# EAGLE design Programming Adaptor v5.0 (EAGLE 6.5.0)
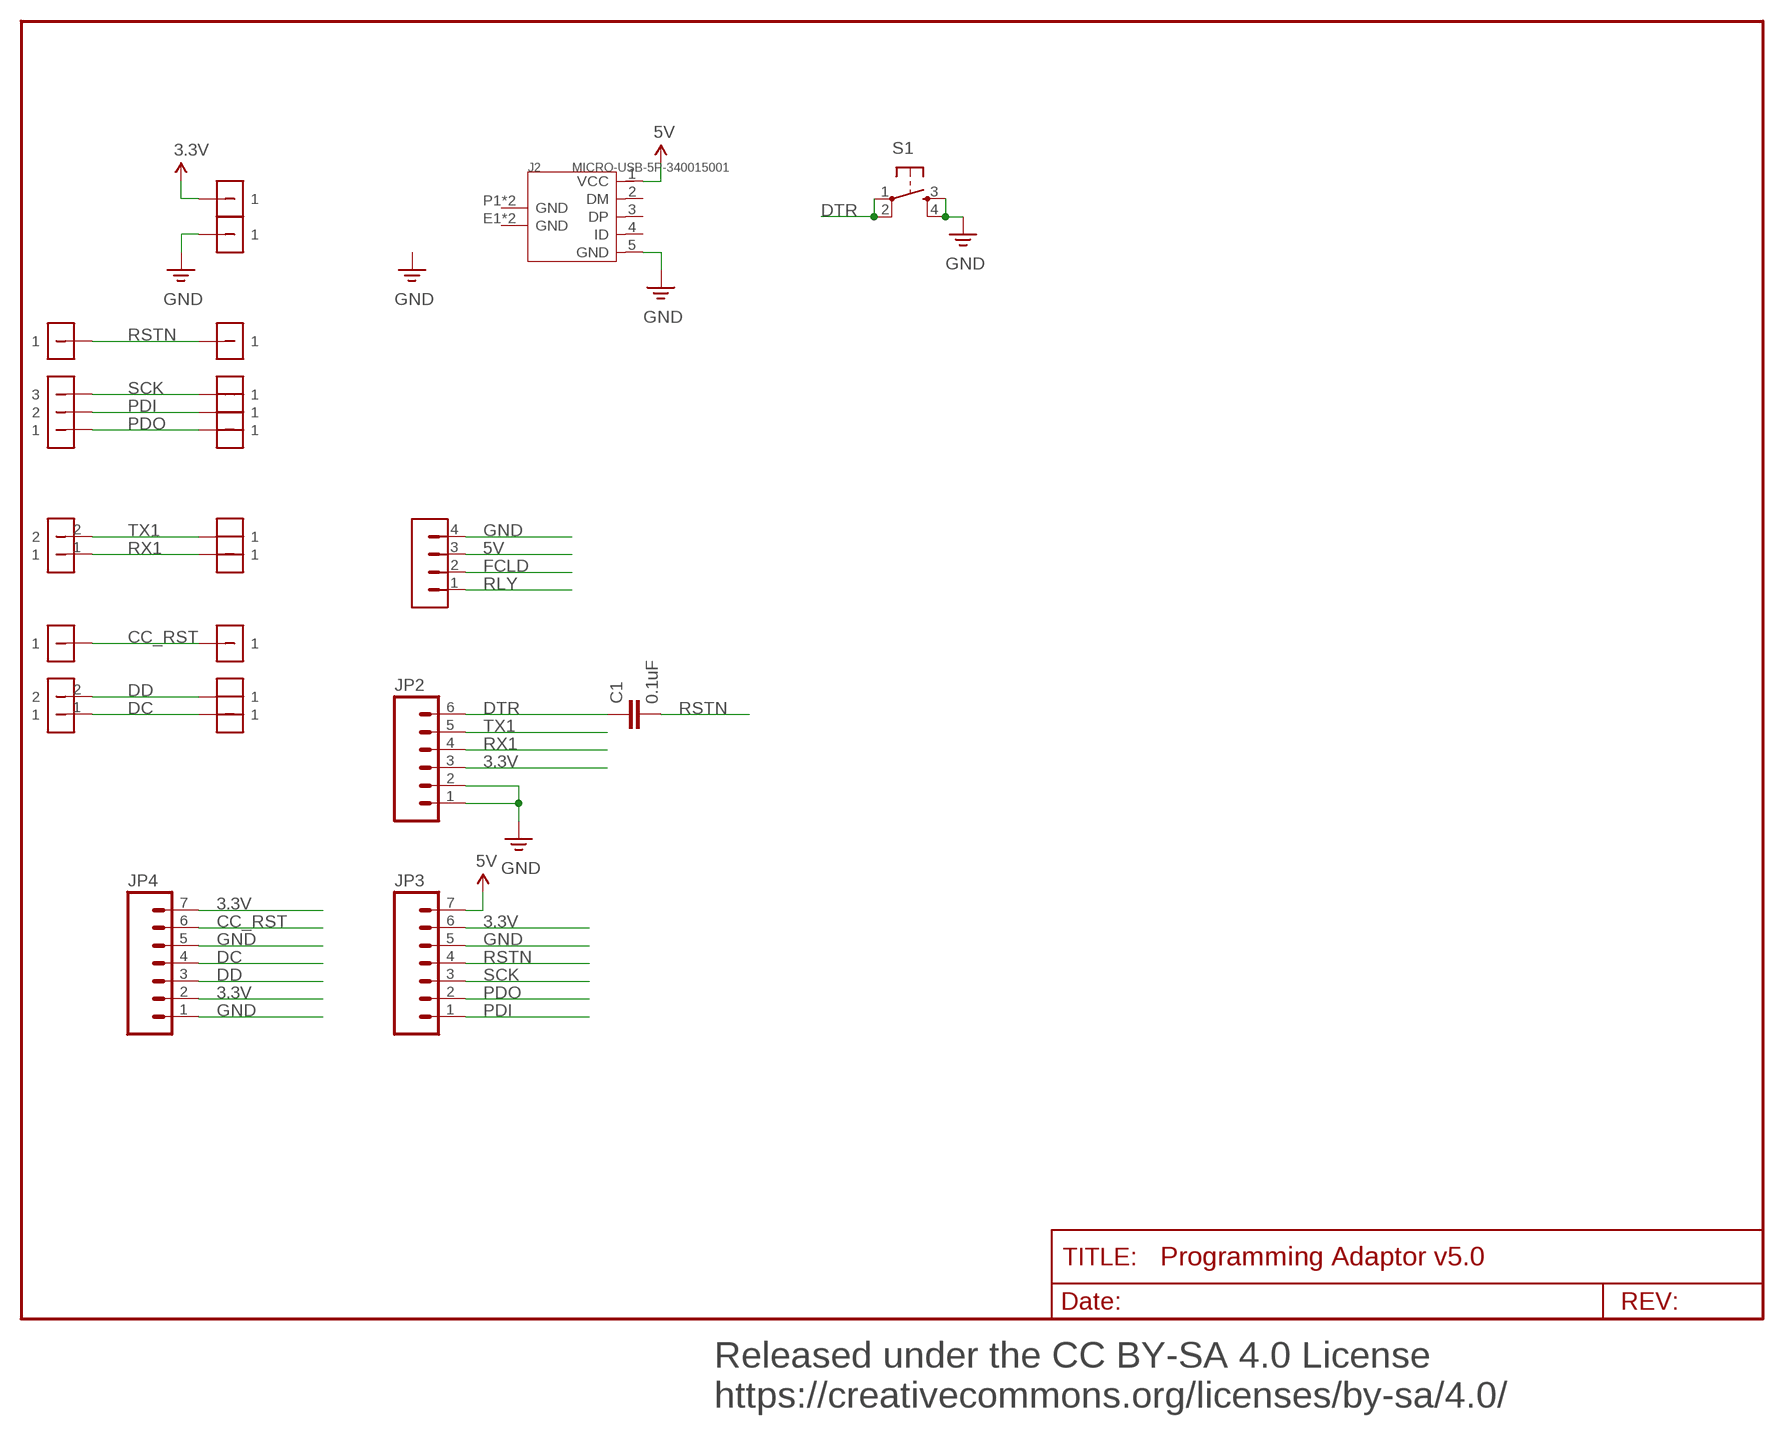
[diagram p0: schematic, sheet 1]

## Parts
C1  0.1uF  CAP0603-CAP  [0603-CAP]
J2  MICRO-USB-5P-340015001  [B-SMD-5P]
JP1  M02  [M02]
JP2  M06LOCK  [1X06_LOCK]
JP3  M07  [1X07]
JP4  M07  [1X07]
S1  TAC_SWITCHSMD  [TACTILE-SWITCH-SMD]
U$4  M03  [M03]
U$5  S04-4MM  [S04-4MM]
U$7  M01  [M01]
U$8  M01  [M01]
U$9  M02  [M02]
U$11  S01C-4MM  [S01C-4MM]
U$12  S01C-4MM  [S01C-4MM]
U$13  S01C-4MM  [S01C-4MM]
U$14  S01C-4MM  [S01C-4MM]
U$15  S01C-4MM  [S01C-4MM]
U$16  S01C-4MM  [S01C-4MM]
U$17  S01C-4MM  [S01C-4MM]
U$18  S01C-4MM  [S01C-4MM]
U$19  S01C-4MM  [S01C-4MM]
U$20  S01C-4MM  [S01C-4MM]
U$21  S01C-4MM  [S01C-4MM]

## Nets
3.3V: JP2.3 JP3.6 JP4.2 JP4.7 U$20.P$1
5V: J2.1(VCC) JP3.7 U$5.3
CC_RST: JP4.6 U$8.1 U$17.P$1
DC: JP4.4 U$9.1 U$19.P$1
DD: JP4.3 U$9.2 U$18.P$1
DTR: C1.1 JP2.6 S1.1 S1.2
FCLD: U$5.2
GND: J2.5(GND) JP2.1 JP2.2 JP3.5 JP4.1 JP4.5 S1.3 S1.4 U$5.4 U$21.P$1
PDI: JP3.1 U$4.2 U$13.P$1
PDO: JP3.2 U$4.1 U$14.P$1
RLY: U$5.1
RSTN: C1.2 JP3.4 U$7.1 U$11.P$1
RX1: JP1.1 JP2.4 U$16.P$1
SCK: JP3.3 U$4.3 U$12.P$1
TX1: JP1.2 JP2.5 U$15.P$1
Unconnected: J2.2(DM) J2.3(DP) J2.4(ID) J2.E1(GND) J2.E2(GND) J2.P1(GND) J2.P2(GND)

## Notes on the sheet
- Released under the CC BY-SA 4.0 License 
  https://creativecommons.org/licenses/by-sa/4.0/

## Library data of the parts
C1 = SparkFun-Capacitors:CAP: Capacitor Standard 0603 ceramic capacitor, and 0.1" leaded capacitor.
J2 = Connector:MICRO-USB-5P: When you use the footprint ,place notice 46 (layer)milling ,there is some important information.
JP1 U$9 = pinhead-half:M02
JP2 = SparkFun-Connectors:M06: Header 6 Standard 6-pin 0.1" header. Use with straight break away headers (SKU : PRT-00116), right angle break away headers (PRT-00553), swiss pins (PRT-00743), machine pins (PRT-00117), and female headers (PRT-00115). Molex polarized connector foot print use with SKU : PRT-08094 with associated crimp pins and housings. NOTES ON THE VARIANTS LOCK and LOCK_LONGPADS... This footprint was designed to help hold the alignment of a through-hole component (i.e. 6-pin header) while soldering it into place. You may notice that each hole has been shifted either up or down by 0.005 of an inch from it's more standard position (which is a perfectly straight line). This slight alteration caused the pins (the squares in the middle) to touch the edges of the holes. Because they are alternating, it causes a "brace" to hold the component in place. 0.005 has proven to be the perfect amount of "off-center" position when using our standard breakaway headers. Although looks a little odd when you look at the bare footprint, once you have a header in there, the alteration is very hard to notice. Also,if you push a header all the way into place, it is covered up entirely on the bottom side. This idea of altering the position of holes to aid alignment will be further integrated into the Sparkfun Library for other footprints. It can help hold any component with 3 or more connection pins.
JP3 JP4 = SparkFun-Connectors:M07: Header 7 Standard 7-pin 0.1" header. Use with straight break away headers (SKU : PRT-00116), right angle break away headers (PRT-00553), swiss pins (PRT-00743), machine pins (PRT-00117), and female headers (PRT-00115). NOTES ON THE VARIANTS LOCK and LOCK_LONGPADS... This footprint was designed to help hold the alignment of a through-hole component (i.e. 7-pin header) while soldering it into place. You may notice that each hole has been shifted either up or down by 0.005 of an inch from it's more standard position (which is usually a perfectly straight line). This slight alteration caused the pins (the squares in the middle) to touch the edges of the holes. Because they are alternating, it causes a "brace" to hold the header in place. 0.005 has proven to be the perfect amount of "off-center" position when using our standard breakaway headers. Although looks a little odd when you look at the bare footprint, once you have a header in there, the alteration is very hard to notice. Also, if you push a header all the way into place, it is covered up entirely on the bottom side. This idea of altering the position of holes to aid alignment will be further integrated into the Sparkfun Library for other footprints. It can help hold any component with 3 or more connection pins.
S1 = SparkFun-Electromechanical:TAC_SWITCH: Momentary Switch Button commonly used for reset or general input. Spark Fun Electronics SKU : COM-00097 SMT- SWCH-08247
U$4 = pinhead-half:M03
U$5 = pinhead-half:S04-4MM
U$7 U$8 = pinhead-half:M01
U$11-U$21 = pinhead-half:S01C-4MM

## Net classes
1 Tline: width 0.003 mm, drill 0.33 mm
2 120v Mains 5A: clearance 1.27 mm

## Board
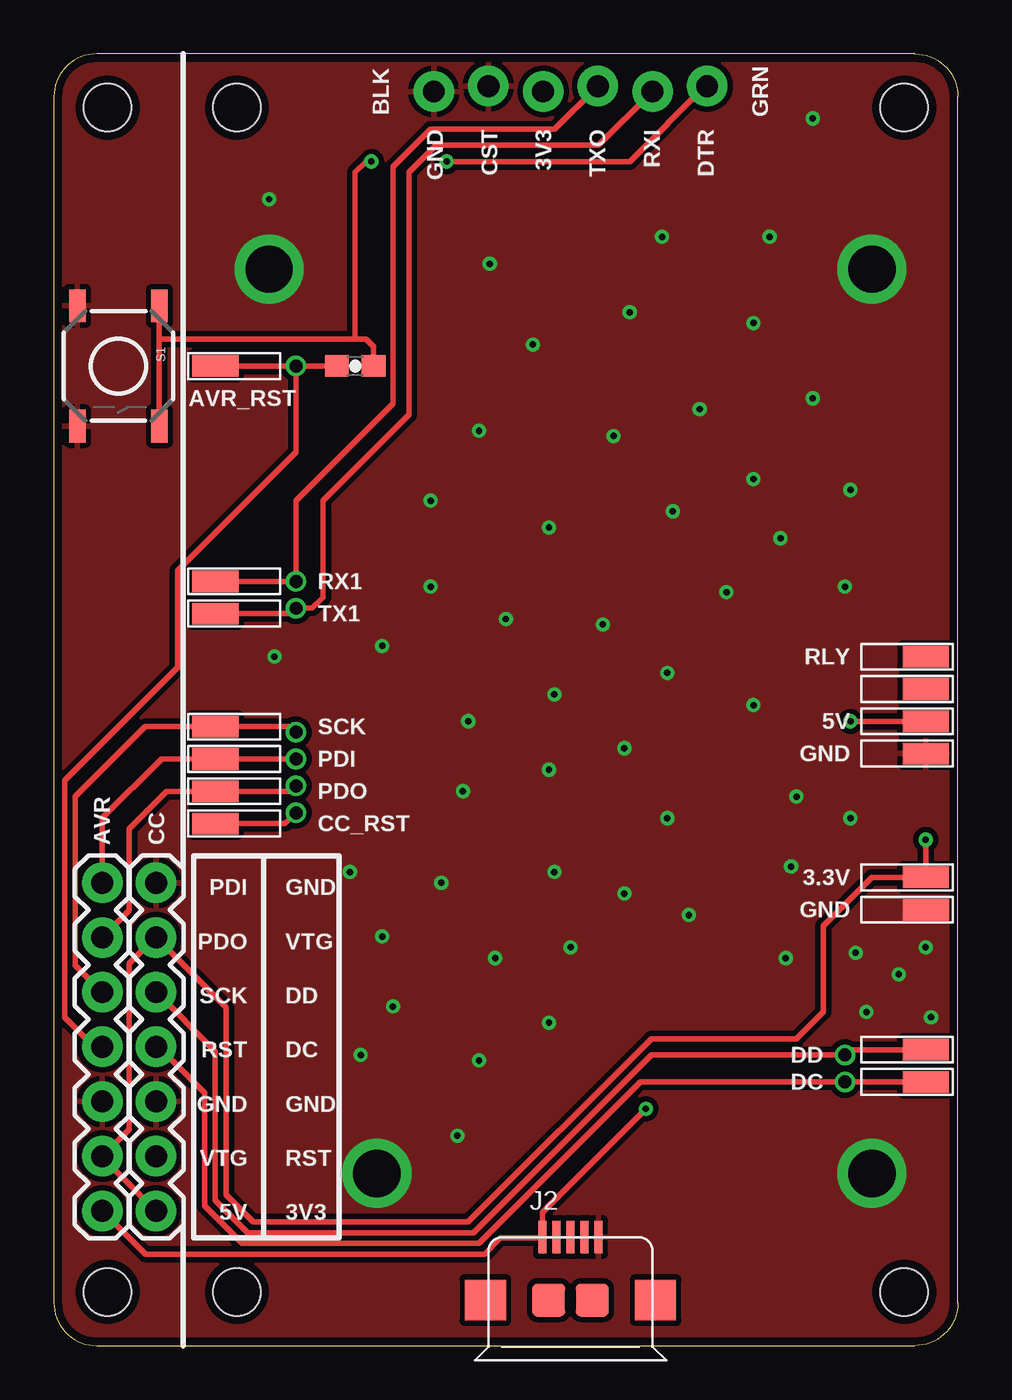
[diagram p1: board, top side]
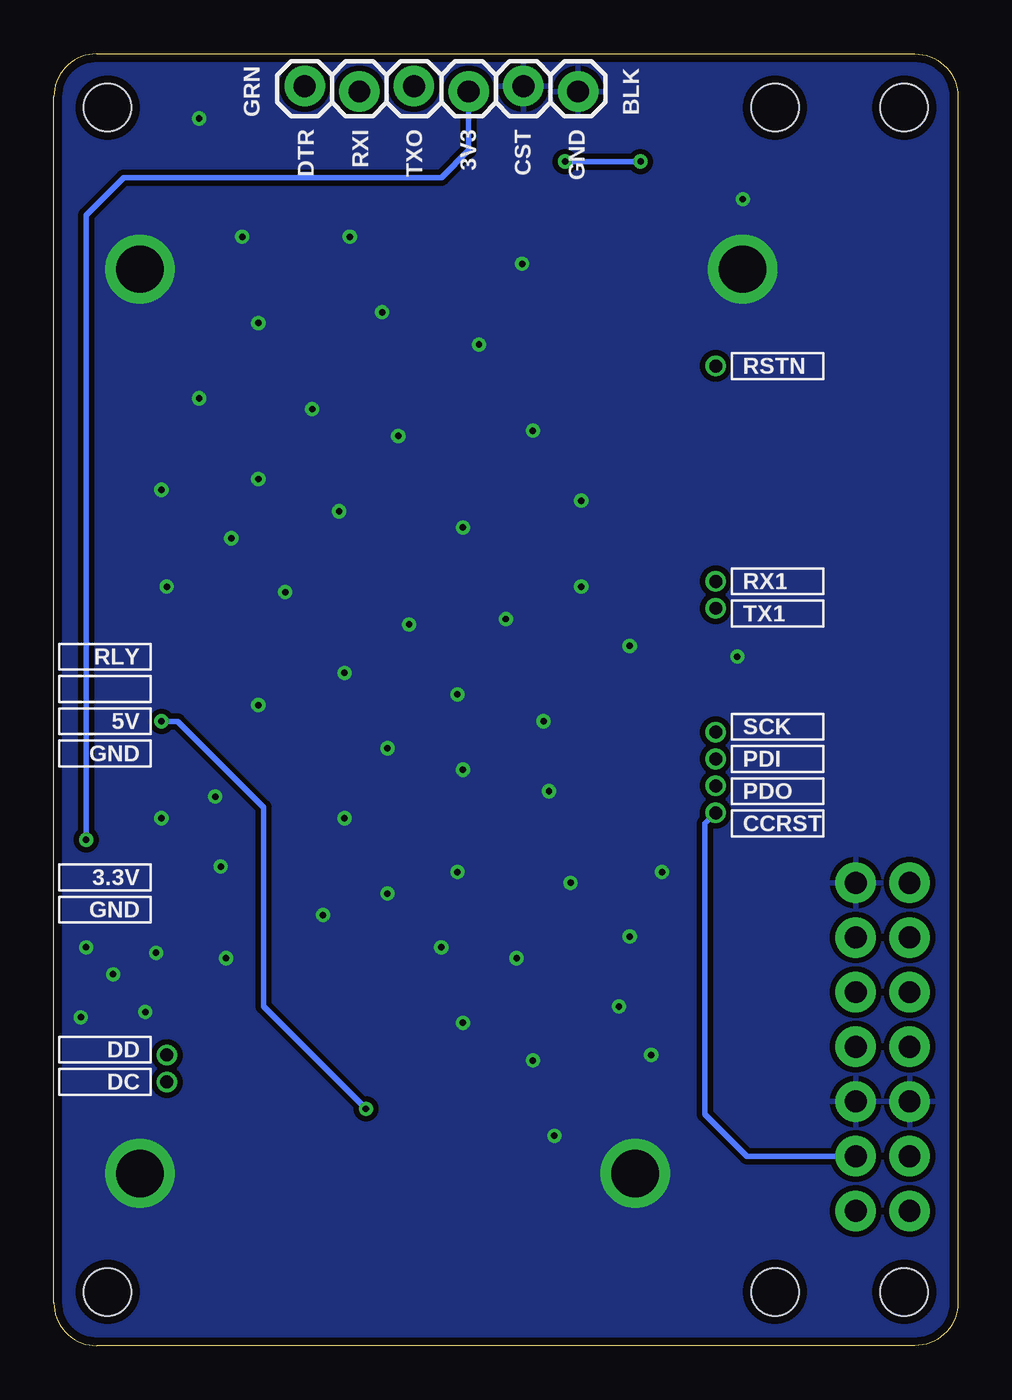
[diagram p2: board, bottom side, seen from below]

Size 42 x 60 mm. Coordinates in mm from the lower left corner, seen from the top.
Outline: 42,2 42,58 arc90 40,60 2,60 arc90 0,58 0,2 arc90 2,0 40,0 arc90 42,2
Copper layers (1*16): Top 0.0356mm / dielectric 1.5011mm / Bottom 0.0356mm
Design rules "LaenPCBOrder *": minimum track width 6mil, minimum drill 0.3mm, track to track 6mil, track to pad 6mil, pad to pad 6mil, via to via 6mil, smd to smd 6mil, copper to edge 15mil, drill to drill 6mil, minimum pad ring 7mil, minimum via ring 7mil, stop-mask expansion 3mil, vias tented up to drill 15mil, thermal gap 10mil
Holes 2.2 mm at 8.5,57.5 39.5,57.5 8.5,2.5 39.5,2.5 2.5,57.5 2.5,2.5

### Footprints (pad centres in the part's own frame; a part is rotated, then mirrored left to right if it is on the bottom)
0603-CAP = smd 1.1 x 1: 1 -0.85,0; 2 0.85,0
B-SMD-5P = smd 0.38 x 1.52: 1 -1.3,2.54; 2 -0.65,2.54; 3 0,2.54; 4 0.65,2.54; 5 1.3,2.54 | smd 1.524 x 1.524: E1 -1.016,-0.381; E2 1.016,-0.381 | smd 1.9 x 1.9: P1 -3.95,-0.381; P2 3.95,-0.381
M02 = drill 0.6: 1 0,0; 2 0,1.25
1X06_LOCK = drill 1.016 pad 1.88: 1 -6.35,0; 2 -3.81,-0.254; 3 -1.27,0; 4 1.27,-0.254; 5 3.81,0; 6 6.35,-0.254
1X07 = drill 1.016 pad 1.88: 1 0,0; 2 2.54,0; 3 5.08,0; 4 7.62,0; 5 10.16,0; 6 12.7,0; 7 15.24,0
TACTILE-SWITCH-SMD = smd 1.524 x 0.762: 1 -2.794,1.905; 2 2.794,1.905; 3 -2.794,-1.905; 4 2.794,-1.905
M03 = drill 0.6: 1 0,-1.25; 2 0,0; 3 0,1.25
S04-4MM = smd 2.15 x 1: 1 0,0; 2 0,1.5; 3 0,3; 4 0,4.5
M01 = drill 0.6: 1 0,0
S01C-4MM = smd 2.15 x 1: P$1 0,0

### Placement (x,y rotation side)
C1  14,45.5 180 top
J2  24,2.5 0 top
JP1  11.25,35.5 180 top
JP2  24,58.25 180 bottom
JP3  2.25,21.5 270 top
JP4  4.75,21.5 270 top
S1  3,45.5 270 top
U$4  11.25,27.25 0 top
U$5  40.5,32 180 top
U$7  11.25,45.5 0 bottom
U$8  11.25,24.75 0 top
U$9  36.75,12.25 0 top
U$11  7.5,45.5 0 top
U$12  7.5,28.75 0 top
U$13  7.5,27.25 0 top
U$14  7.5,25.75 0 top
U$15  7.5,34 0 top
U$16  7.5,35.5 0 top
U$17  7.5,24.25 0 top
U$18  40.5,13.75 180 top
U$19  40.5,12.25 180 top
U$20  40.5,21.75 180 top
U$21  40.5,20.25 180 top

### Tracks (layer width: path | path; a pad name or v marks a point on that pad's centre or on a via)
3.3V  (via drill 0.3)
  Top 0.25: JP4.7 4.64,6.5 4.5,6.5 2.2,8.8 JP3.6 3.5,10.05 3.5,17.75 4.62,18.87 JP4.2 8,15.71 8,7 9.25,5.75 19.25,5.75 27.75,14.25 34.5,14.25 35.75,15.5 35.75,19.5 38,21.75 U$20.P$1 v40.5,23.5
  Bottom 0.25: JP2.3 22.73,55.52 24,54.25 38.75,54.25 40.5,52.5 v40.5,23.5
5V  (via drill 0.3)
  Top 0.25: JP3.7 4.26,4.25 20,4.25 20.75,5 22.66,5 J2.1 22.7,6.2 v27.5,11 | v37,29 U$5.3
  Bottom 0.25: v27.5,11 32.25,15.75 32.25,25 36.25,29 v37,29
CC_RST
  Top 0.25: U$17.P$1 10.75,24.25 U$8.1
  Bottom 0.25: JP4.6 9.8,8.8 11.75,10.75 11.75,24.25 U$8.1
DC
  Top 0.25: U$19.P$1 U$9.1 27.25,12.25 19.75,4.75 8.75,4.75 7,6.5 7,11.75 4.87,13.88 JP4.4
DD
  Top 0.25: U$18.P$1 37,13.75 U$9.2 27.75,13.5 19.5,5.25 9,5.25 7.5,6.75 7.5,13.67 JP4.3
DTR  (via drill 0.3)
  Top 0.25: S1.1 4.91,46.75 | 4.91,46.75 S1.2 | C1.1 14.85,46.4 14.5,46.75 14,46.75 | 14,46.75 4.91,46.75 | JP2.6 30.25,58.5 26.75,55 v18.25,55 | v14.75,55 14.5,55 14,54.5 14,46.75
  Bottom 0.25: v18.25,55 v14.75,55
GND  (via drill 0.3, 2.2)
  other vias: 10,50 38,50 38,8 15,8 28.5,31.25 37,24.5 34.25,22.25 32.5,29.75 28.5,24.5 34,18 34.5,25.5 39.25,17.25 37.25,18.25 37.75,15.5 40.75,15.25 40.5,18.5 29.5,20 26.5,27.75 25.5,33.5 31.25,35 36.75,35.25 37,39.75 32.5,40.25 33.75,37.5 28.75,38.75 23,38 26,42.25 30,43.5 35.25,44 32.5,47.5 26.75,48 22.25,46.5 19.75,42.5 20.25,50.25 28.25,51.5 33.25,51.5 35.25,57 10,53.25 17.5,39.25 17.5,35.25 15.25,32.5 10.25,32 21,33.75 19.25,29 23,26.75 23.25,30.25 19,25.75 23.25,22 18,21.5 24,18.5 15.25,19 20.5,18 13.75,22 15.75,15.75 14.25,13.5 19.75,13.25 26.5,21 23,15 18.75,9.75
  pour Top (isolate 0.254): 44,62 -2,62 -2,-2 44,-2
  pour Bottom (isolate 0.254): -1,61 -1,-1 43,-1 43,61
PDI
  Top 0.25: U$4.2 U$13.P$1 5,27.25 2.25,24.5 JP3.1
PDO
  Top 0.25: U$4.1 11,25.75 U$14.P$1 5.25,25.75 3.5,24 3.5,20.21 JP3.2
RSTN
  Top 0.25: U$11.P$1 U$7.1 | U$7.1 C1.2 | JP3.4 1.87,13.88 0.5,15.25 0.5,26.25 5.75,31.5 5.75,36 11.25,41.5 U$7.1
RX1
  Top 0.25: U$16.P$1 JP1.1 11.25,39.25 15.75,43.75 15.75,54.75 17.5,56.5 23.27,56.5 JP2.4
SCK
  Top 0.25: U$4.3 11,28.75 U$12.P$1 4.25,28.75 1,25.5 1,17.67 JP3.3
TX1
  Top 0.25: U$15.P$1 11,34 JP1.2 12,34.25 12.5,34.75 12.5,39.25 16.5,43.25 16.5,54.5 17.75,55.75 25.31,55.75 JP2.5

### Text on the board
tPlace: BLK / / / / / / / GRN | GND / CST / 3V3 / TXO / RXI / DTR | AVR_RST | RX1 | TX1 | RLY | SCK | 5V | GND | PDI | PDO | CC_RST | AVR / CC | 3.3V | GND | PDI / PDO / SCK / RST / GND / VTG / 5V | GND / VTG / DD / DC / GND / RST / 3V3 | DD | DC | Released under the CC BY-SA 4.0 License / https://creativecommons.org/licenses/by-sa/4.0/
bPlace: GRN / / / / / / / BLK | DTR / RXI / TXO / 3V3 / CST / GND | RSTN | RX1 | TX1 | RLY | SCK | 5V | GND | PDI | PDO | CCRST | 3.3V | GND | DD | DC